# Altium schematic sheet MidDac.SchDoc
size A3
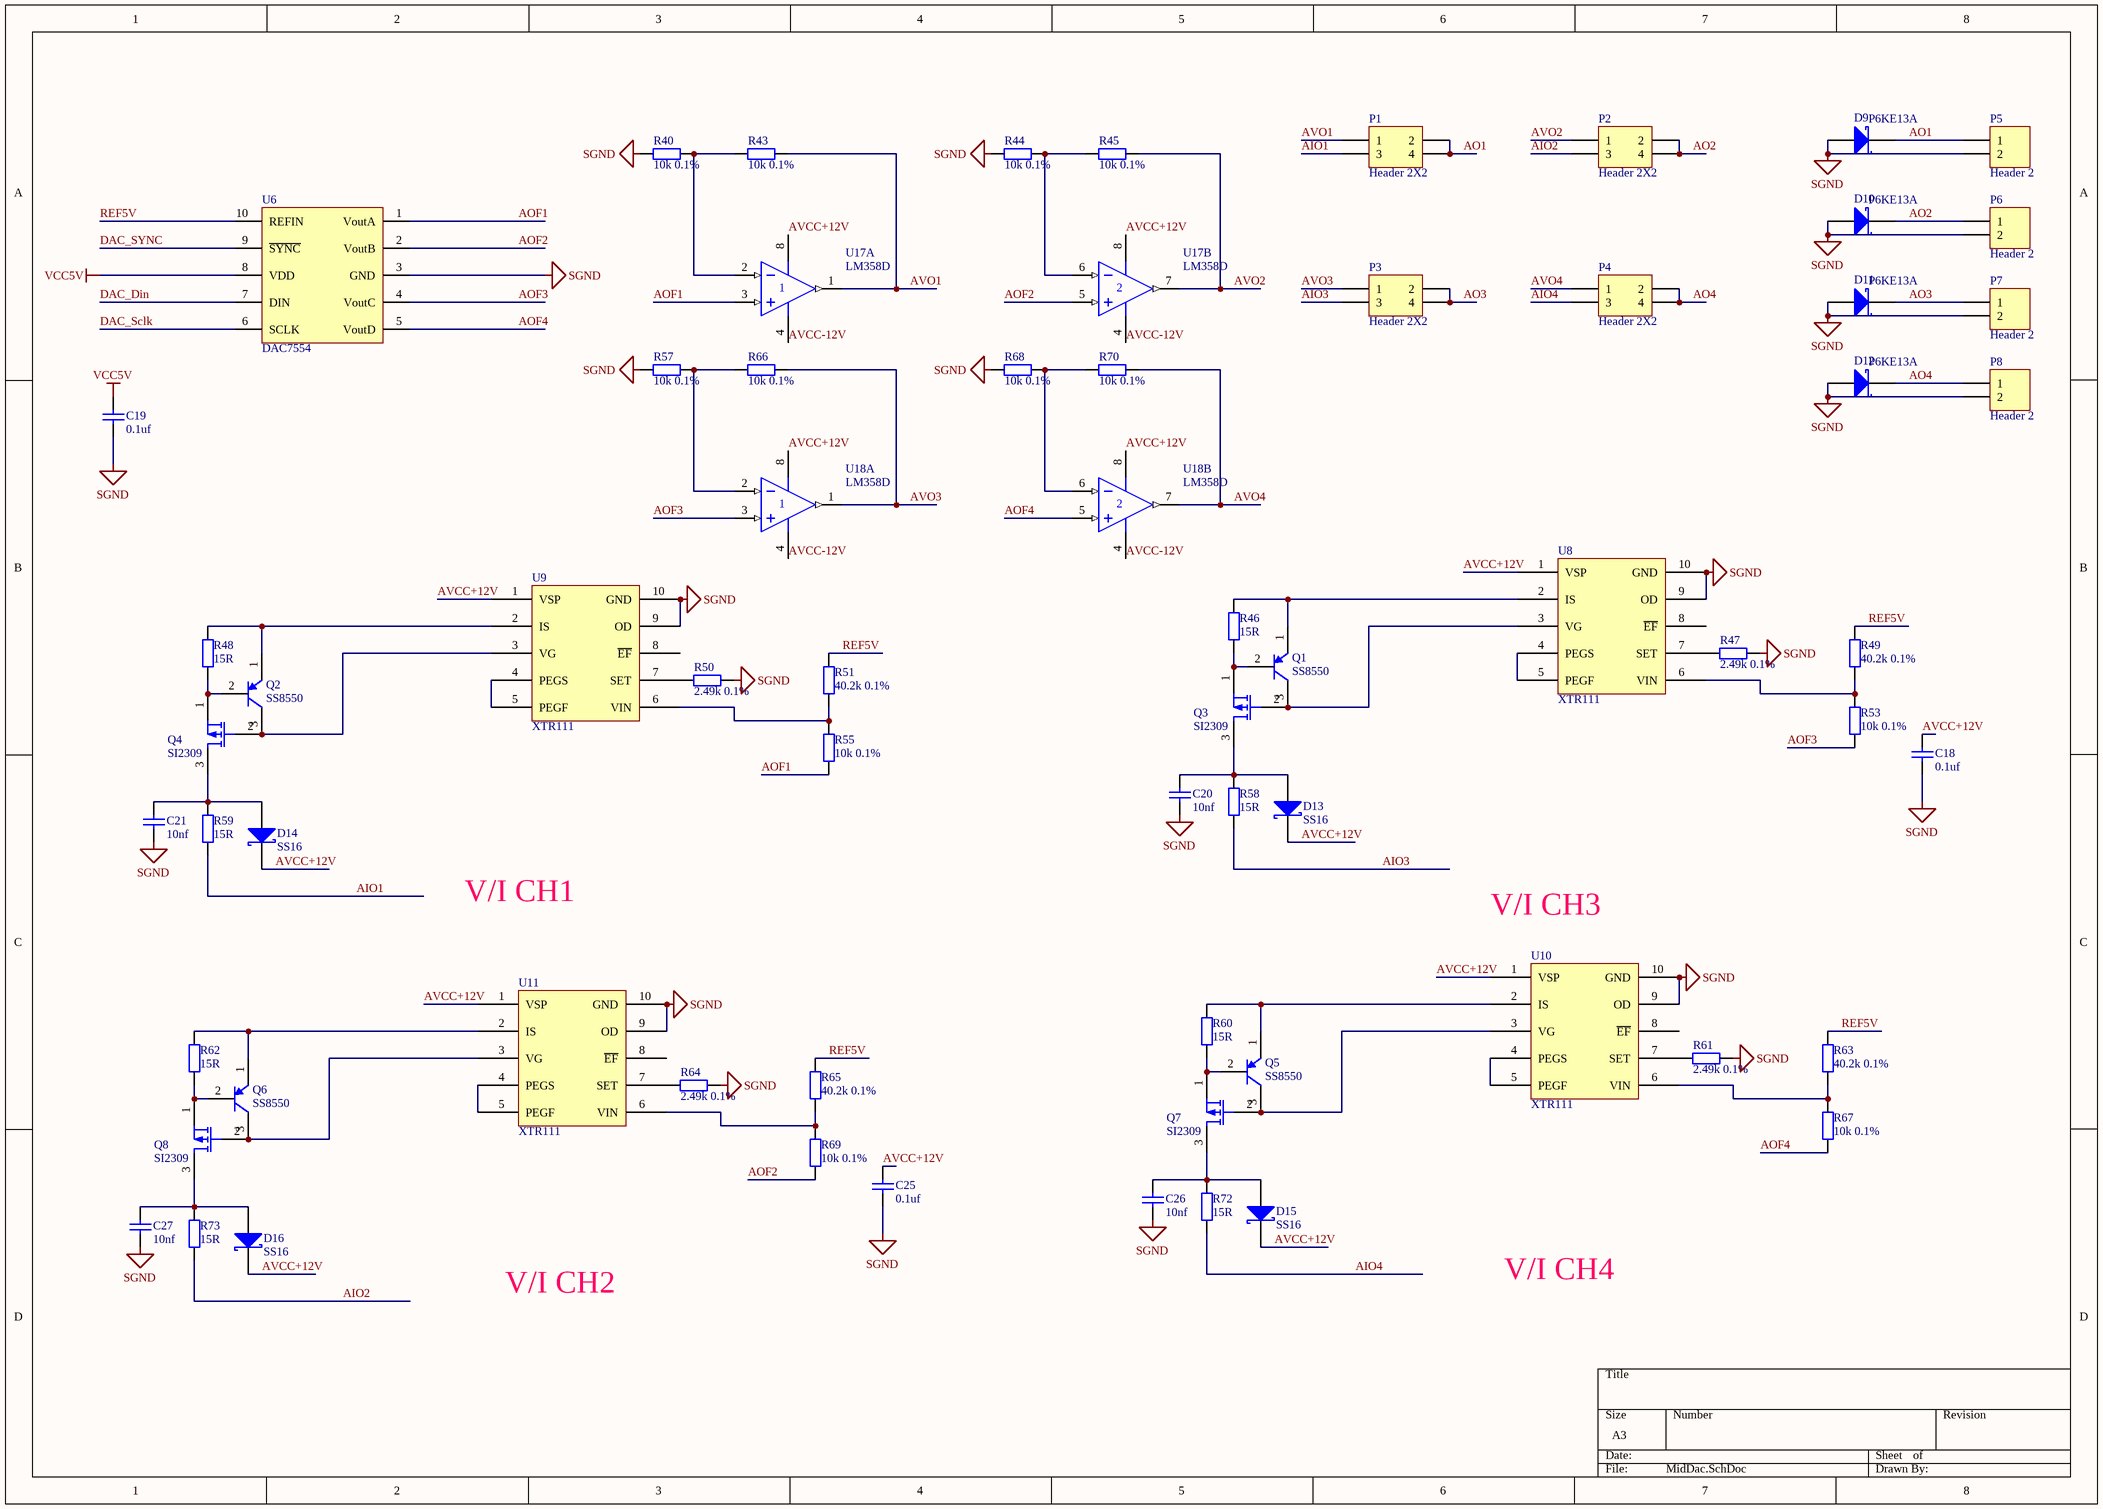
[diagram p0: MidDac.SchDoc]

## Parts
C18  value 0.1uf  [C0805]  (hidden comment: Cap)
C19  value 0.1uf  [C0805]  (hidden comment: Cap)
C20  value 10nf  [C0805]  (hidden comment: Cap)
C21  value 10nf  [C0805]  (hidden comment: Cap)
C25  value 0.1uf  [C0805]  (hidden comment: Cap)
C26  value 10nf  [C0805]  (hidden comment: Cap)
C27  value 10nf  [C0805]  (hidden comment: Cap)
D9  P6KE13A  [SMB]
D10  P6KE13A  [SMB]
D11  P6KE13A  [SMB]
D12  P6KE13A  [SMB]
D13  SS16  [SMB]
D14  SS16  [SMB]
D15  SS16  [SMB]
D16  SS16  [SMB]
P1  Header 2X2  [HDR2X2]
P2  Header 2X2  [HDR2X2]
P3  Header 2X2  [HDR2X2]
P4  Header 2X2  [HDR2X2]
P5  Header 2  [3.5-P2]
P6  Header 2  [3.5-P2]
P7  Header 2  [3.5-P2]
P8  Header 2  [3.5-P2]
Q1  SS8550  [sot-23]
Q2  SS8550  [sot-23]
Q3  SI2309  [sot-23]
Q4  SI2309  [sot-23]
Q5  SS8550  [sot-23]
Q6  SS8550  [sot-23]
Q7  SI2309  [sot-23]
Q8  SI2309  [sot-23]
R40  value 10k 0.1%  [0805]  (hidden comment: Res2)
R43  value 10k 0.1%  [0805]  (hidden comment: Res2)
R44  value 10k 0.1%  [0805]  (hidden comment: Res2)
R45  value 10k 0.1%  [0805]  (hidden comment: Res2)
R46  value 15R  [0805]  (hidden comment: Res2)
R47  value 2.49k 0.1%  [0805]  (hidden comment: Res2)
R48  value 15R  [0805]  (hidden comment: Res2)
R49  value 40.2k 0.1%  [0805]  (hidden comment: Res2)
R50  value 2.49k 0.1%  [0805]  (hidden comment: Res2)
R51  value 40.2k 0.1%  [0805]  (hidden comment: Res2)
R53  value 10k 0.1%  [0805]  (hidden comment: Res2)
R55  value 10k 0.1%  [0805]  (hidden comment: Res2)
R57  value 10k 0.1%  [0805]  (hidden comment: Res2)
R58  value 15R  [0805]  (hidden comment: Res2)
R59  value 15R  [0805]  (hidden comment: Res2)
R60  value 15R  [0805]  (hidden comment: Res2)
R61  value 2.49k 0.1%  [0805]  (hidden comment: Res2)
R62  value 15R  [0805]  (hidden comment: Res2)
R63  value 40.2k 0.1%  [0805]  (hidden comment: Res2)
R64  value 2.49k 0.1%  [0805]  (hidden comment: Res2)
R65  value 40.2k 0.1%  [0805]  (hidden comment: Res2)
R66  value 10k 0.1%  [0805]  (hidden comment: Res2)
R67  value 10k 0.1%  [0805]  (hidden comment: Res2)
R68  value 10k 0.1%  [0805]  (hidden comment: Res2)
R69  value 10k 0.1%  [0805]  (hidden comment: Res2)
R70  value 10k 0.1%  [0805]  (hidden comment: Res2)
R72  value 15R  [0805]  (hidden comment: Res2)
R73  value 15R  [0805]  (hidden comment: Res2)
U6  DAC7554  [VSSOP10]
U8  XTR111  [TSSOP-10_P]
U9  XTR111  [TSSOP-10_P]
U10  XTR111  [TSSOP-10_P]
U11  XTR111  [TSSOP-10_P]
U17  LM358D  [751-02_N]  (parts A,B of 2)
U18  LM358D  [751-02_N]  (parts A,B of 2)

## Nets
SGND: C18.2 C19.2 C20.2 C21.2 C25.2 C26.2 C27.2 D9.1(A) D10.1(A) D11.1(A) D12.1(A) P5.2 P6.2 P7.2 P8.2 R40.1 R44.1 R47.2 R50.2 R57.1 R61.2 R64.2 R68.1 U6.3(GND) U8.9(OD) U8.10(GND) U9.9(OD) U9.10(GND) U10.9(OD) U10.10(GND) U11.9(OD) U11.10(GND)
VCC5V: C19.1 U6.8(VDD)
AIO1: P1.3 R59.2
AIO2: P2.3 R73.2
AIO3: P3.3 R58.2
AIO4: P4.3 R72.2
AO1: D9.2(K) P1.2 P1.4 P5.1
AO2: D10.2(K) P2.2 P2.4 P6.1
AO3: D11.2(K) P3.2 P3.4 P7.1
AO4: D12.2(K) P4.2 P4.4 P8.1
AOF1: R55.2 U6.1(VoutA) U17.3(IN+)
AOF2: R69.2 U6.2(VoutB) U17.5(IN+)
AOF3: R53.2 U6.4(VoutC) U18.3(IN+)
AOF4: R67.2 U6.5(VoutD) U18.5(IN+)
AVCC+12V: C18.1 C25.1 D13.2(K) D14.2(K) D15.2(K) D16.2(K) U8.1(VSP) U9.1(VSP) U10.1(VSP) U11.1(VSP) U17.8(V+) U18.8(V+)
AVCC-12V: U17.4(V-) U18.4(V-)
AVO1: P1.1 R43.2 U17.1(OUT)
AVO2: P2.1 R45.2 U17.7(OUT)
AVO3: P3.1 R66.2 U18.1(OUT)
AVO4: P4.1 R70.2 U18.7(OUT)
DAC_Din: U6.7(DIN)
DAC_Sclk: U6.6(SCLK)
DAC_SYNC: U6.9(~{SYNC})
REF5V: R49.1 R51.1 R63.1 R65.1 U6.10(REFIN)
NetC20_1: C20.1 D13.1(A) Q3.3(D) R58.1
NetC21_1: C21.1 D14.1(A) Q4.3(D) R59.1
NetC26_1: C26.1 D15.1(A) Q7.3(D) R72.1
NetC27_1: C27.1 D16.1(A) Q8.3(D) R73.1
NetQ1_1: Q1.1(E) R46.1 U8.2(IS)
NetQ1_2: Q1.2(B) Q3.1(S) R46.2
NetQ1_3: Q1.3(C) Q3.2(G) U8.3(VG)
NetQ2_1: Q2.1(E) R48.1 U9.2(IS)
NetQ2_2: Q2.2(B) Q4.1(S) R48.2
NetQ2_3: Q2.3(C) Q4.2(G) U9.3(VG)
NetQ5_1: Q5.1(E) R60.1 U10.2(IS)
NetQ5_2: Q5.2(B) Q7.1(S) R60.2
NetQ5_3: Q5.3(C) Q7.2(G) U10.3(VG)
NetQ6_1: Q6.1(E) R62.1 U11.2(IS)
NetQ6_2: Q6.2(B) Q8.1(S) R62.2
NetQ6_3: Q6.3(C) Q8.2(G) U11.3(VG)
NetR40_2: R40.2 R43.1 U17.2(IN-)
NetR44_2: R44.2 R45.1 U17.6(IN-)
NetR47_1: R47.1 U8.7(SET)
NetR49_2: R49.2 R53.1 U8.6(VIN)
NetR50_1: R50.1 U9.7(SET)
NetR51_2: R51.2 R55.1 U9.6(VIN)
NetR57_2: R57.2 R66.1 U18.2(IN-)
NetR61_1: R61.1 U10.7(SET)
NetR63_2: R63.2 R67.1 U10.6(VIN)
NetR64_1: R64.1 U11.7(SET)
NetR65_2: R65.2 R69.1 U11.6(VIN)
NetR68_2: R68.2 R70.1 U18.6(IN-)
NetU8_4: U8.4(PEGS) U8.5(PEGF)
NetU9_4: U9.4(PEGS) U9.5(PEGF)
NetU10_4: U10.4(PEGS) U10.5(PEGF)
NetU11_4: U11.4(PEGS) U11.5(PEGF)

Not connected (* = marked no-connect by the designer): U8 8(~{EF}); U9 8(~{EF}); U10 8(~{EF}); U11 8(~{EF})

## Notes on the sheet
- V/I CH1
- V/I CH3
- V/I CH2
- V/I CH4

## Library data of the parts
C18-C21 C25-C27 = Cap: Capacitor; Manufacturer: Generic Components; Class: Passive; Published: 08/06/2000; Publisher: Altium Hobart Technology Centre; SubClass: Capacitor
D9-D16 = D Schottky: Schottky Diode; Published: 8-Jun-2000; LatestRevisionDate: 17-Jul-2002; LatestRevisionNote: Re-released for DXP Platform.; PackageReference: SMB; Publisher: Altium Limited; Code_JEDEC: DO-214-AA
P1-P4 = Header 2X2: Header, 2-Pin, Dual row; LatestRevisionDate: 17-Jul-2002; LatestRevisionNote: Re-released for DXP Platform.; Publisher: Altium Limited
P5-P8 = Header 2: Header, 2-Pin; LatestRevisionDate: 17-Jul-2002; LatestRevisionNote: Re-released for DXP Platform.; Publisher: Altium Limited
Q1 Q2 Q5 Q6 = 2N3906: PNP General Purpose Amplifier; Published: 8-Jun-2000; LatestRevisionDate: 15-Jan-2003; LatestRevisionNote: PCB Footprint 'BCY-W3/D4.7' replaced; DatasheetVersion: 1997; PackageVersion: Sep-1998; PackageReference: TO-92A; Publisher: Altium Limited; PackageDescription: TO, Flat Index; 3 In-Line, Axial Leads; Body Dia. 4.5mm; Leads 0.51 x 0.48 mm (max); ComponentLink1Description: Manufacturer Link; ComponentLink1URL: http://www.fairchildsemi.com/; ComponentLink2Description: Datasheet; ComponentLink2URL: http://www.fairchildsemi.com/ds/2N%2F2N3906.pdf
Q3 Q4 Q7 Q8 = MOSFET-P: P-Channel MOSFET; Published: 8-Jun-2000; LatestRevisionDate: 17-Jul-2002; LatestRevisionNote: Re-released for DXP Platform.; PackageVersion: 1995/1996; PackageReference: E3; Publisher: Altium Limited; PackageDescription: TO, Flat Index; 3 In-Line, Axial Leads; Body Dia. 4.6mm; Lead Dia. 0.5 mm (max)
R40 R43-R51 R53 R55 R57-R70 R72 R73 = RES
U8-U11 = XT
U17 U18 = LM358D: Dual Low-Power Operational Amplifier; Published: 17-Jul-2002; LatestRevisionDate: 13-Apr-2006; LatestRevisionNote: IPC-7351 Footprint Added.; DatasheetVersion: 1988; PackageReference: 751-02; Publisher: Altium Limited; PackageDescription: 8-Pin Small Outline Integrated Circuit 1.27 mm Pitch; Code_JEDEC: MS-012-AA; Code_IPC: SOIC127P600-8; ComponentLink1Description: Manufacturer Link; ComponentLink1URL: http://www.onsemi.com/site/products/parametrics/0,4446,251,00.html; ComponentLink2Description: Datasheet; ComponentLink2URL: http://www.onsemi.com/pub/Collateral/LM358-D.PDF